# EAGLE schematic Schematic_Sensing_Module (EAGLE 9.6.2)
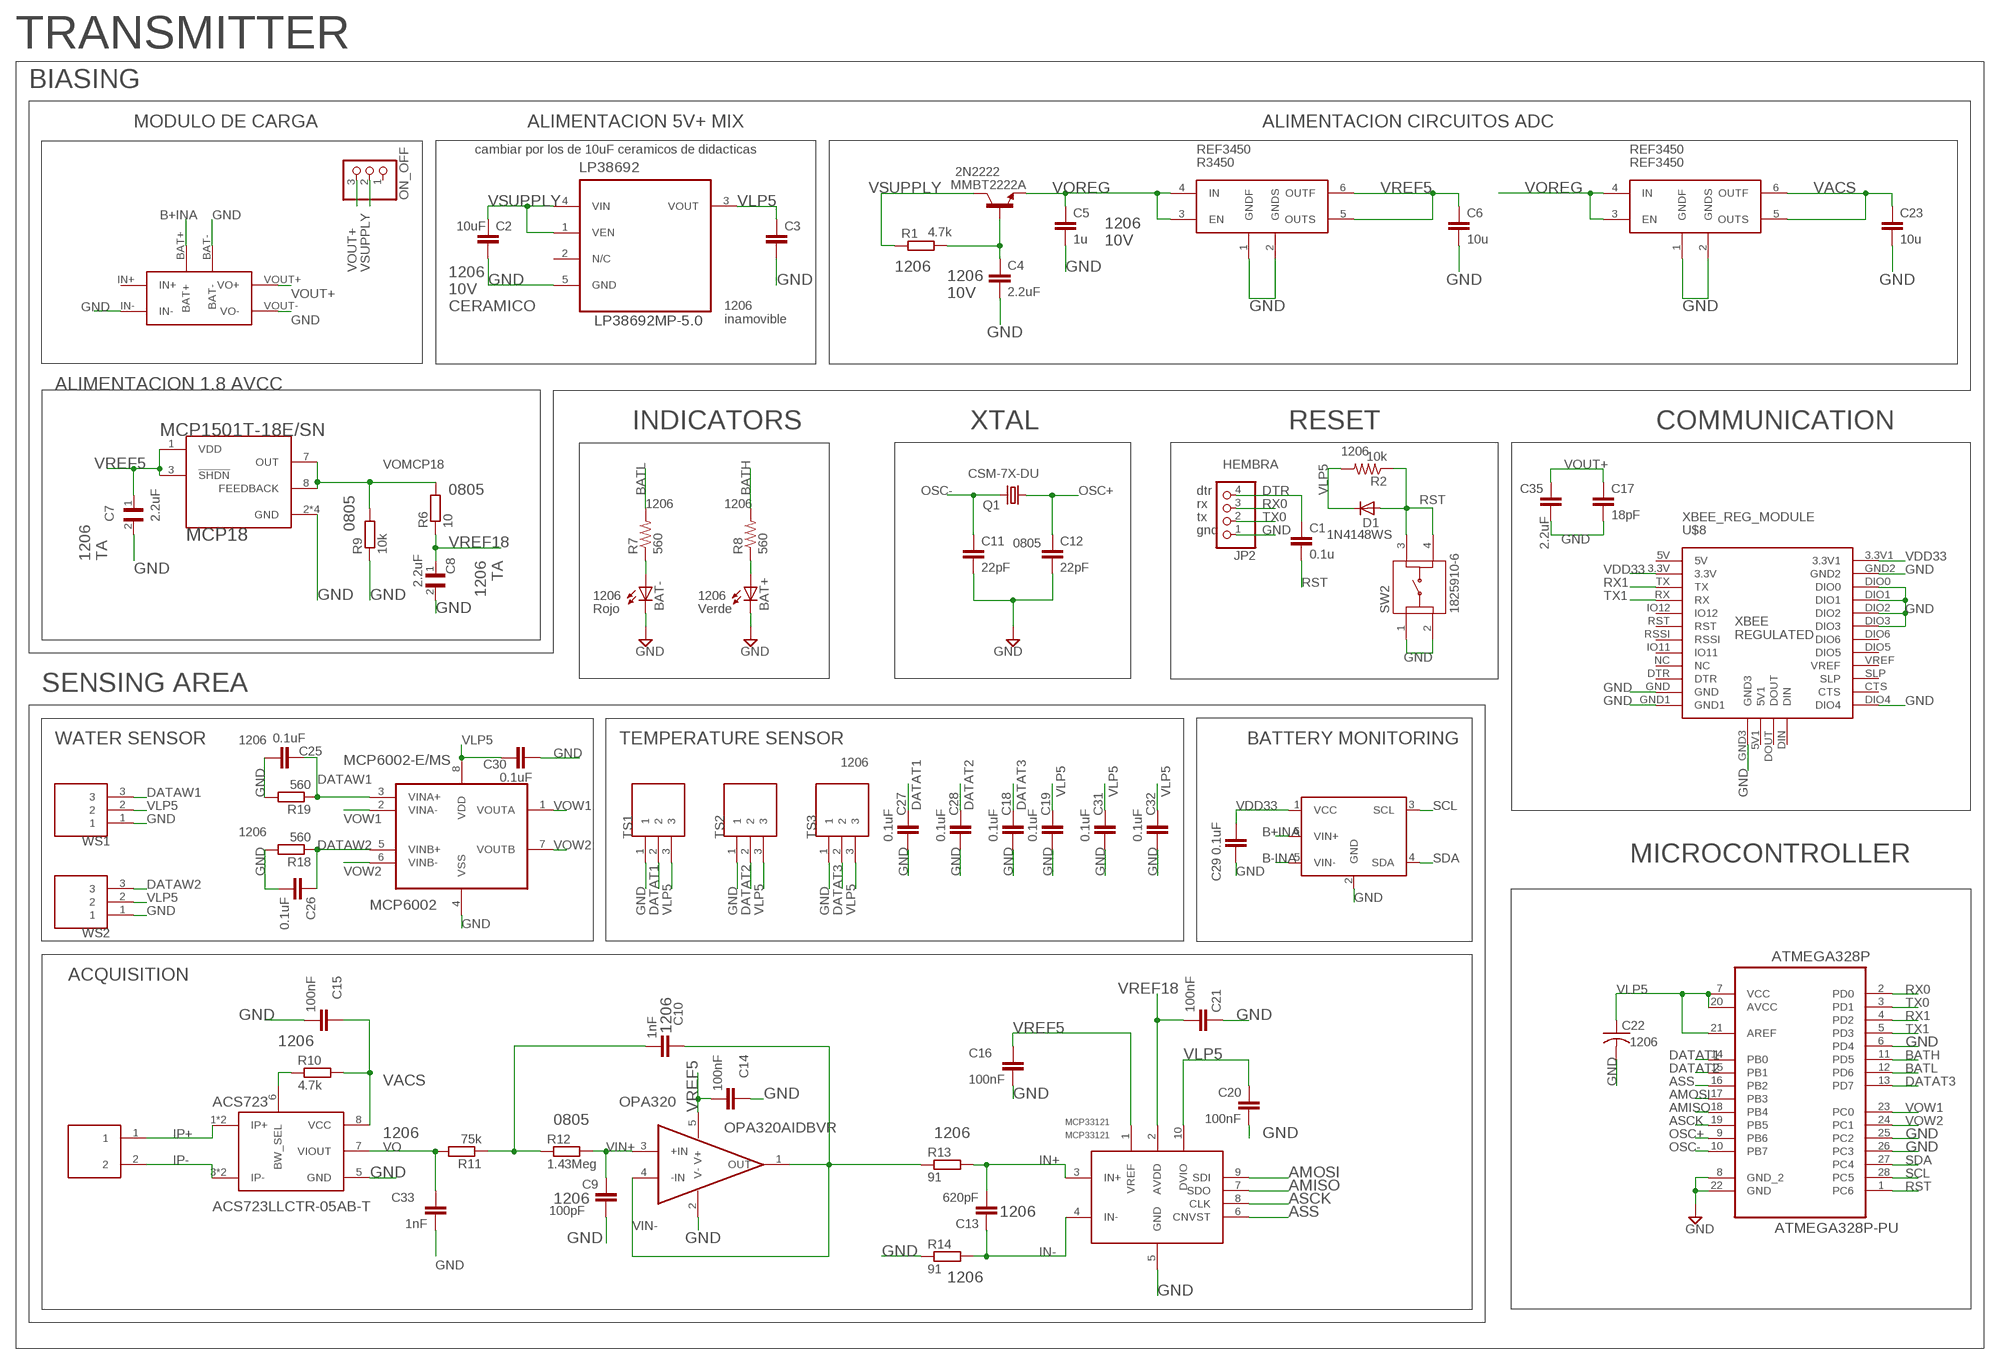
[diagram p0: schematic, sheet 1]

## Parts
2N2222  MMBT2222A  [SOT23]
ACS723  ACS723LLCTR-05AB-T  [SOIC127P600X175-8N]
ATMEGA328P  ATMEGA328P-PU  [DIP254P762X457-28]
BAT+  LEDCHIPLED_1206  [CHIPLED_1206]
BAT-  LEDCHIPLED_1206  [CHIPLED_1206]
C1  0.1u  C-EUC0805  [C0805]
C2  10uF  C-EUC1206  [C1206]
C3  10uF  C-EUC1206  [C1206]
C4  2.2uF  C-EUC1206  [C1206]
C5  1u  C-EUC1206  [C1206]
C6  10u  C-EUC1206  [C1206]
C7  2.2uF  T491A106K010AT7280  [CAPC3216X110N]
C8  2.2uF  T491A106K010AT7280  [CAPC3216X110N]
C9  100pF  C-EUC1206  [C1206]
C10  1nF  C-EUC1206  [C1206]
C11  22pF  C-EUC0805  [C0805]
C12  22pF  C-EUC0805  [C0805]
C13  620pF  C-EUC1206  [C1206]
C14  100nF  C-EUC1206  [C1206]
C15  100nF  C-EUC1206  [C1206]
C16  100nF  C-EUC1206  [C1206]
C17  18pF  C-EUC0805  [C0805]
C18  0.1uF  C-EUC1206  [C1206]
C19  0.1uF  C-EUC1206  [C1206]
C20  100nF  C-EUC1206  [C1206]
C21  100nF  C-EUC1206  [C1206]
C22  0.1uF  C-USC1206  [C1206]
C23  10u  C-EUC1206  [C1206]
C25  0.1uF  C-EUC1206  [C1206]
C26  0.1uF  C-EUC1206  [C1206]
C27  0.1uF  C-EUC1206  [C1206]
C28  0.1uF  C-EUC1206  [C1206]
C29  0.1uF  C-EUC1206  [C1206]
C30  0.1uF  C-EUC1206  [C1206]
C31  0.1uF  C-EUC1206  [C1206]
C32  0.1uF  C-EUC1206  [C1206]
C33  1nF  C-EUC1206  [C1206]
C35  2.2uF  C-EUC1206  [C1206]
D1  1N4148WS  [SOD323]
IACT  TERMINAL-TB2  [TERMINAL-TB2]
INA219  INABB  [INA219-MODULE]
JP2  PINHD-1X4  [1X04]
LP38692  LP38692MP-5.0  [SOT150P696X180-5N]
MCP18  MCP1501T-18E/SN  [SOIC127P600X175-8N]
MCP6002  MCP6002-E/MS  [SOP65P490X110-8N]
MCP33121  MCP33121  [MSOP10]
ON_OFF  PINHD-1X3  [1X03]
OPA320  OPA320AIDBVR  [SOT95P280X145-5N]
Q1  CSM-7X-DU  [CSM-7X-DU]
R1  4.7k  R-EU_R1206  [R1206]
R2  10k  R-US_R1206  [R1206]
R6  10  R-EU_R0805  [R0805]
R7  560  R-US_R1206  [R1206]
R8  560  R-US_R1206  [R1206]
R9  10k  R-EU_R0805  [R0805]
R10  4.7k  R-EU_M1206  [M1206]
R11  75k  R-EU_R1206  [R1206]
R12  1.43Meg  R-EU_R0805  [R0805]
R13  91  R-EU_R1206  [R1206]
R14  91  R-EU_R1206  [R1206]
R18  560  R-EU_R1206  [R1206]
R19  560  R-EU_R1206  [R1206]
R3450  REF3450  [SOT95P280X145-6N]
REF3450  REF3450  [SOT95P280X145-6N]
SW2  1825910-6  [SW_1825910-6-4]
TS1  TERMINAL-TB3  [TERMINAL-TB3]
TS2  TERMINAL-TB3  [TERMINAL-TB3]
TS3  TERMINAL-TB3  [TERMINAL-TB3]
U$1  MODULO_CARGA_DEVICE  [MODULO_CARGA]
U$8  XBEE_REG_MODULE  [XBEE_REG]
WS1  TERMINAL-TB3  [TERMINAL-TB3]
WS2  TERMINAL-TB3  [TERMINAL-TB3]

## Nets
AMISO: ATMEGA328P.18(PB4) MCP33121.7(SDO)
AMOSI: ATMEGA328P.17(PB3) MCP33121.9(SDI)
ASCK: ATMEGA328P.19(PB5) MCP33121.8(CLK)
ASS: ATMEGA328P.16(PB2) MCP33121.6(CNVST)
B+INA: INA219.6(VIN+) U$1.BAT+
B-INA: INA219.5(VIN-)
BATH: ATMEGA328P.11(PD5) R8.2
BATL: ATMEGA328P.12(PD6) R7.2
BWSEL: ACS723.6(BW_SEL) R10.1
DATAT1: ATMEGA328P.14(PB0) C27.1 TS1.2
DATAT2: ATMEGA328P.15(PB1) C28.1 TS2.2
DATAT3: ATMEGA328P.13(PD7) C18.1 TS3.2
DATAW1: C25.1 MCP6002.3(VINA+) R19.1 WS1.3
DATAW2: C26.1 MCP6002.5(VINB+) R18.1 WS2.3
DTR: C1.1 JP2.4
GND: ACS723.5(GND) ATMEGA328P.6(PD4) ATMEGA328P.8(GND_2) ATMEGA328P.22(GND) ATMEGA328P.25(PC2) ATMEGA328P.26(PC3) BAT+.C BAT-.C C2.2 C3.2 C4.2 C5.2 C6.2 C7.2 C8.2 C9.2 C11.2 C12.2 C14.1 C15.2 C16.2 C17.2 C18.2 C19.2 C20.2 C21.1 C22.2 C23.2 C25.2 C26.2 C27.2 C28.2 C29.2 C30.2 C31.2 C32.2 C33.2 C35.2 INA219.2(GND) JP2.1 LP38692.5(GND) MCP18.2(GND) MCP18.4(GND) MCP18.5(GND) MCP18.6(GND) MCP6002.4(VSS) MCP33121.5(GND) OPA320.2(V-) R9.1 R14.1 R18.2 R19.2 R3450.1(GNDF) R3450.2(GNDS) REF3450.1(GNDF) REF3450.2(GNDS) SW2.1 SW2.2 TS1.1 TS2.1 TS3.1 U$1.BAT- U$1.IN- U$1.VOUT-(VO-) U$8.DIO0 U$8.DIO1 U$8.DIO2 U$8.DIO3 U$8.DIO4 U$8.GND U$8.GND1 U$8.GND2 U$8.GND3 WS1.1 WS2.1
IN+: C13.2 MCP33121.3(IN+) R13.2
IN-: C13.1 MCP33121.4(IN-) R14.2
IP+: ACS723.1(IP+) ACS723.2(IP+) IACT.1
IP-: ACS723.3(IP-) ACS723.4(IP-) IACT.2
N$2: 2N2222.1(B) C4.1 R1.2
N$3: BAT-.A R7.1
N$4: BAT+.A R8.1
N$14: C10.2 R11.1 R12.1
OSC+: ATMEGA328P.9(PB6) C12.1 Q1.1
OSC-: ATMEGA328P.10(PB7) C11.1 Q1.2
RST: ATMEGA328P.1(PC6) C1.2 D1.A R2.1 SW2.3 SW2.4
RX0: ATMEGA328P.2(PD0) JP2.3
RX1: ATMEGA328P.4(PD2) U$8.TX
SCL: ATMEGA328P.28(PC5) INA219.3(SCL)
SDA: ATMEGA328P.27(PC4) INA219.4(SDA)
TX0: ATMEGA328P.3(PD1) JP2.2
TX1: ATMEGA328P.5(PD3) U$8.RX
VACS: ACS723.8(VCC) C15.1 C23.1 R10.2 REF3450.5(OUTS) REF3450.6(OUTF)
VDD33: C29.1 INA219.1(VCC) U$8.3.3V U$8.3.3V1
VIN+: C9.1 OPA320.3(+IN) R12.2
VIN-: C10.1 OPA320.1(OUT) OPA320.4(-IN) R13.1
VLP5: ATMEGA328P.7(VCC) ATMEGA328P.20(AVCC) ATMEGA328P.21(AREF) C3.1 C19.1 C20.1 C22.1 C30.1 C31.1 C32.1 D1.C LP38692.3(VOUT) MCP6002.8(VDD) MCP33121.10(DVIO) R2.2 TS1.3 TS2.3 TS3.3 WS1.2 WS2.2
VO: ACS723.7(VIOUT) C33.1 R11.2
VOMCP18: MCP18.7(OUT) MCP18.8(FEEDBACK) R6.2 R9.2
VOREG: 2N2222.2(E) C5.1 R3450.3(EN) R3450.4(IN) REF3450.3(EN) REF3450.4(IN)
VOUT+: C17.1 C35.1 ON_OFF.3 U$1.VOUT+(VO+)
VOW1: ATMEGA328P.23(PC0) MCP6002.1(VOUTA) MCP6002.2(VINA-)
VOW2: ATMEGA328P.24(PC1) MCP6002.6(VINB-) MCP6002.7(VOUTB)
VREF5: C6.1 C7.1 C14.2 C16.1 MCP18.1(VDD) MCP18.3(!SHDN) MCP33121.1(VREF) OPA320.5(V+) R3450.5(OUTS) R3450.6(OUTF)
VREF18: C8.1 C21.2 MCP33121.2(AVDD) R6.1
VSUPPLY: 2N2222.3(C) C2.1 LP38692.1(VEN) LP38692.4(VIN) ON_OFF.2 R1.1
Unconnected: LP38692.2(N/C) ON_OFF.1 U$1.IN+ U$8.5V U$8.5V1 U$8.CTS U$8.DIN U$8.DIO5 U$8.DIO6 U$8.DOUT U$8.DTR U$8.IO11 U$8.IO12 U$8.NC U$8.RSSI U$8.RST U$8.SLP U$8.VREF

## Notes on the sheet
- TRANSMITTER
- BIASING
- MODULO DE CARGA | ALIMENTACION 5V+ MIX | ALIMENTACION CIRCUITOS ADC
- cambiar por los de 10uF ceramicos de didacticas
- 1206 
  10V
- 1206
- 1206 
  10V
- 1206 
  10V
  CERAMICO
- 1206
  inamovible
- ALIMENTACION 1.8 AVCC
- INDICATORS | XTAL | RESET | COMMUNICATION
- 1206
- HEMBRA
- 0805 | 0805 | dtr
- 1206 | 1206 | rx
- tx
- gnd
- 0805
- 1206
  TA
- 1206
  TA
- 1206 | 1206
- Rojo | Verde
- SENSING AREA
- WATER SENSOR | 1206 | TEMPERATURE SENSOR | BATTERY MONITORING
- 1206
- 1206
- MICROCONTROLLER
- ACQUISITION
- 1206
- 1206 | 1206
- 0805
- 1206 | 1206
- 1206
- 1206
- 1206

## Library data of the parts
2N2222 = MMBT2222A:MMBT2222A: 2N2222 General Purpose NPN Transistor Check prices <https://pricing.snapeda.com/parts/MMBT2222A/ON%20Semiconductor/view-part?ref=eda>; AVAILABILITY: Good; DESCRIPTION: Bipolar (BJT) Transistor NPN 40V 600mA 300MHz 225mW Surface Mount SOT-23; MF: ON Semiconductor; MP: MMBT2222A; PACKAGE: None; PRICE: None
ACS723 = ACS723LLCTR-05AB-T:ACS723LLCTR-05AB-T: High Accuracy, Galvanically Isolated Current Sensor IC With Small Footprint SOIC8 Package Check prices <https://pricing.snapeda.com/parts/ACS723LLCTR-05AB-T/ALPS/view-part?ref=eda>; AVAILABILITY: Warning; DESCRIPTION: Current Sensor 5A 1 Channel Hall Effect, Open Loop Bidirectional 8-SOIC (0.154, 3.90mm Width); MF: ALPS; MP: ACS723LLCTR-05AB-T; PACKAGE: SOIC-8 Allegro MicroSystems; PRICE: None; PURCHASE-URL: https://pricing.snapeda.com/search/part/ACS723LLCTR-05AB-T/?ref=eda
ATMEGA328P = Atmel_By_element14_Batch_1-00:ATMEGA328P-PU: 8-bit Microcontroller with In-System Programmable Flash; MPN: ATMEGA328P-PU; OC_FARNELL: 1715487; OC_NEWARK: 15R0268; PACKAGE: PDIP-28; SUPPLIER: Atmel
BAT+ BAT- = led:LED: LED OSRAM: - CHIPLED LG R971, LG N971, LY N971, LG Q971, LY Q971, LO R971, LY R971 LH N974, LH R974 LS Q976, LO Q976, LY Q976 LO Q996 - Hyper CHIPLED LW Q18S LB Q993, LB Q99A, LB R99A - SideLED LS A670, LO A670, LY A670, LG A670, LP A670 LB A673, LV A673, LT A673, LW A673 LH A674 LY A675 LS A676, LA A676, LO A676, LY A676, LW A676 LS A679, LY A679, LG A679 - Hyper Micro SIDELED® LS Y876, LA Y876, LO Y876, LY Y876 LT Y87S - SmartLED LW L88C, LW L88S LB L89C, LB L89S, LG L890 LS L89K, LO L89K, LY L89K LS L896, LA L896, LO L896, LY L896 - TOPLED LS T670, LO T670, LY T670, LG T670, LP T670 LSG T670, LSP T670, LSY T670, LOP T670, LYG T670 LG T671, LOG T671, LSG T671 LB T673, LV T673, LT T673, LW T673 LH T674 LS T676, LA T676, LO T676, LY T676, LB T676, LH T676, LSB T676, LW T676 LB T67C, LV T67C, LT T67C, LS T67K, LO T67K, LY T67K, LW E67C LS E67B, LA E67B, LO E67B, LY E67B, LB E67C, LV E67C, LT E67C LW T67C LS T679, LY T679, LG T679 LS T770, LO T770, LY T770, LG T770, LP T770 LB T773, LV T773, LT T773, LW T773 LH T774 LS E675, LA E675, LY E675, LS T675 LS T776, LA T776, LO T776, LY T776, LB T776 LHGB T686 LT T68C, LB T68C - Hyper Mini TOPLED® LB M676 - Mini TOPLED Santana® LG M470 LS M47K, LO M47K, LY M47K Source: http://www.osram.convergy.de LUXEON: - LUMILED® LXK2-PW12-R00, LXK2-PW12-S00, LXK2-PW14-U00, LXK2-PW14-V00 LXK2-PM12-R00, LXK2-PM12-S00, LXK2-PM14-U00 LXK2-PE12-Q00, LXK2-PE12-R00, LXK2-PE12-S00, LXK2-PE14-T00, LXK2-PE14-U00 LXK2-PB12-K00, LXK2-PB12-L00, LXK2-PB12-M00, LXK2-PB14-N00, LXK2-PB14-P00, LXK2-PB14-Q00 LXK2-PR12-L00, LXK2-PR12-M00, LXK2-PR14-Q00, LXK2-PR14-R00 LXK2-PD12-Q00, LXK2-PD12-R00, LXK2-PD12-S00 LXK2-PH12-R00, LXK2-PH12-S00 LXK2-PL12-P00, LXK2-PL12-Q00, LXK2-PL12-R00 Source: www.luxeon.com KINGBRIGHT: KA-3528ASYC Source: www.kingbright.com
C1 C17 = rcl:C-EU: CAPACITOR, European symbol
C2-C6 C9-C16 C18-C21 C23 C25-C33 C35 = rcl:C-EU: CAPACITOR, European symbol; SPICEPREFIX: C
C7 C8 = T491A106K010AT7280:T491A106K010AT7280: CAP TANT 10UF 10V 10% 1206; DESCRIPTION: 10µF Molded Tantalum Capacitors 10V 1206 (3216 Metric) 3.8Ohm; DIGI-KEY_PART_NUMBER: 399-8268-2-ND; MF: KEMET; MP: T491A106K010AT7280; PACKAGE: 1206 Kemet; PURCHASE-URL: https://pricing.snapeda.com/search/part/T491A106K010AT7280/?ref=eda
C22 = rcl:C-US: CAPACITOR, American symbol
D1 = 1N4148WS:1N4148WS: http://octopart.com/1n4148ws-fairchild+semiconductor-7851016; AVAILABILITY: Unavailable; DESCRIPTION: Diode Switching 75V 0.3A 2-Pin SOD-323 T/R; MF: ON Semiconductor; MP: 1N4148WS; PACKAGE: S-0 Good-Ark; PRICE: None
IACT = TERMINAL-TB001:TERMINAL-TB2
INA219 = INA219BB:INABB
JP2 = pinhead:PINHD-1X4: PIN HEADER
LP38692 = LP38692MP-5.0:LP38692MP-5.0: Linear Regulator Check prices <https://pricing.snapeda.com/parts/LP38692MP-5.0/Texas%20Instruments/view-part?ref=eda>; AVAILABILITY: Warning; DESCRIPTION: 1-A, 10-V, low-dropout voltage regulator with enable 5-SOT-223 -40 to 125; MF: Texas Instruments; MP: LP38692MP-5.0; PACKAGE: SOT-223-5 Texas Instruments; PRICE: None; PURCHASE-URL: https://pricing.snapeda.com/search/part/LP38692MP-5.0/?ref=eda
MCP18 = MCP1501T-18E_SN:MCP1501T-18E/SN: High Precision Buffered Voltage Reference; AVAILABILITY: Unavailable; DESCRIPTION: Series Voltage Reference IC ±0.1% 8-SOIC; MF: Microchip; MP: MCP1501T-18E/SN; PACKAGE: SOIC-8 Microchip; PRICE: None
MCP6002 = MCP6002-E_MS:MCP6002-E/MS: Check prices <https://pricing.snapeda.com/parts/MCP6002-E/MS/Microchip%20Technology/view-part?ref=eda>; AVAILABILITY: Good; DESCRIPTION: IC OPAMP GP 2 CIRCUIT 8MSOP; MF: Microchip Technology; MP: MCP6002-E/MS; PACKAGE: MSOP-8 Microchip; PRICE: None; PURCHASE-URL: https://pricing.snapeda.com/search/part/MCP6002-E/MS/?ref=eda
MCP33121 = mcp33121:MCP33121
ON_OFF = pinhead:PINHD-1X3: PIN HEADER
OPA320 = OPA320AIDBVR:OPA320AIDBVR; DESCRIPTION: Precision, Zero-Crossover, 20MHz, 0.9pA Ib, RRIO, CMOS Operational Amplifier 5-SOT-23 -40 to 125; DIGI-KEY_PART_NUMBER: 296-29480-1-ND; MF: Texas Instruments; MP: OPA320AIDBVR; PACKAGE: SOT-23-5 Texas Instruments; PURCHASE-URL: https://pricing.snapeda.com/search/part/OPA320AIDBVR/?ref=eda
Q1 = crystal:CSM-7X-DU: SMD CRYSTAL Source: www.ecsxtal.com .. Crystal 3.6864MHz CSM_7X_DU.PDF; OC_FARNELL: unknown; OC_NEWARK: unknown
R1 R6 R9-R14 R18 R19 = rcl:R-EU_: RESISTOR, European symbol; SPICEPREFIX: R
R2 R7 R8 = rcl:R-US_: RESISTOR, American symbol
R3450 REF3450 = SOT95P280X145-6N:REF3450
SW2 = button1825910-6:1825910-6: Switch Tactile OFF (ON) SPST Round Button PC Pins 0.05A 24VDC 100000Cycles 1.57N Thru-Hole Loose; AVAILABILITY: Unavailable; COMMENT: 1825910-6; CONFIGURATION_POLE-THROW: Single Pole - Single Throw; CONTACT_CURRENT_RATING: 50 mA; DESCRIPTION: Switch Push Button OFF _ON_ SPST Round Button 0.05A 24VDC Momentary Contact PC Pins Thru-Hole; EU_ROHS_COMPLIANCE: Compliant; MF: TE Connectivity; MP: 1825910-6; PACKAGE: None; PRICE: None; TE_PURCHASE_URL: https://www.te.com/usa-en/product-1825910-6.html?te_bu=Cor&te_type=disp&te_campaign=seda_glo_cor-seda-global-disp-prtnr-fy19-seda-model-bom-cta_sma-317_1&elqCampaignId=32493
TS1-TS3 WS1 WS2 = TERMINAL-TB001:TERMINAL-TB3: Check prices <https://pricing.snapeda.com/parts/TB001-500-03BE/CUI%20Devices/view-part?ref=eda>; AVAILABILITY: Good; CUI_PURCHASE_URL: https://www.cuidevices.com/product/interconnect/connectors/terminal-blocks/tb001-500-series?utm_source=snapeda.com&utm_medium=referral&utm_campaign=snapedaBOM; DESCRIPTION: 2~24 Poles, Screw Type, Horizontal, 5.0 Pitch, 22~12 (AWG), Terminal Block Connector; MF: CUI Devices; MP: TB001-500-03BE; PACKAGE: None; PRICE: None; PURCHASE-URL: https://pricing.snapeda.com/search/part/TB001-500-03BE/?ref=eda
U$1 = Modulo_Carga:MODULO_CARGA_DEVICE
U$8 = XBEE_REG:XBEE_REG_MODULE